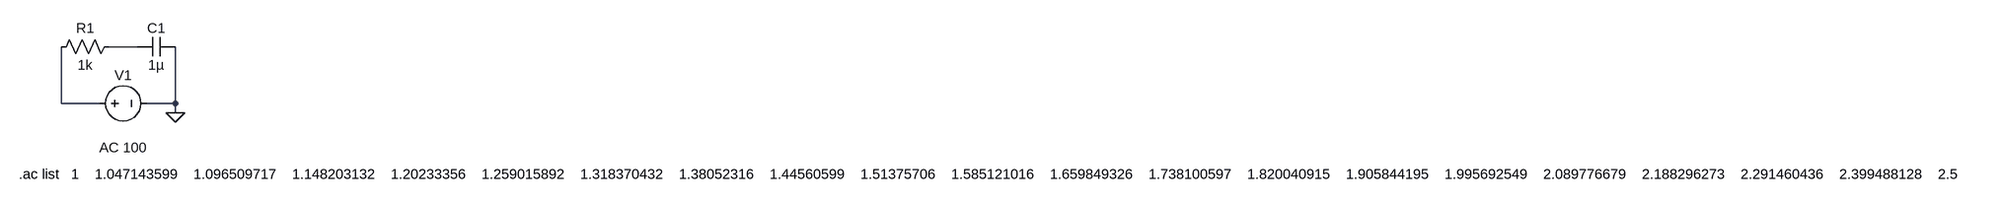
[diagram p0: schematic ac_low_high_pass_filter.asc]
ac_low_high_pass_filter.asc, the LTspice schematic file:
Version 4
SHEET 1 25912 680
WIRE 288 80 240 80
WIRE 160 176 160 80
WIRE 224 176 160 176
WIRE 352 176 352 80
WIRE 352 176 304 176
WIRE 352 192 352 176
FLAG 352 192 0
SYMBOL res 256 64 R90
WINDOW 0 0 56 VBottom 2
WINDOW 3 32 56 VTop 2
SYMATTR InstName R1
SYMATTR Value 1k
SYMBOL cap 352 64 R90
WINDOW 0 0 32 VBottom 2
WINDOW 3 32 32 VTop 2
SYMATTR InstName C1
SYMATTR Value 1µ
SYMBOL voltage 208 176 R270
WINDOW 0 32 56 VTop 2
WINDOW 3 -32 56 VBottom 2
WINDOW 123 -60 56 VBottom 2
WINDOW 39 0 0 Left 2
SYMATTR InstName V1
SYMATTR Value ""
SYMATTR Value2 AC 100
TEXT 88 296 Left 2 !.ac list   1	1.047143599	1.096509717	1.148203132	1.20233356	1.259015892	1.318370432	1.38052316	1.44560599	1.51375706	1.585121016	1.659849326	1.738100597	1.820040915	1.905844195	1.995692549	2.089776679	2.188296273	2.291460436	2.399488128	2.512608635	2.631062049	2.755099784	2.884985104	3.020993686	3.163414201	3.312548933	3.468714412	3.632242094	3.80347906	3.982788752	4.170551749	4.367166569	4.573050519	4.78864058	5.014394333	5.250790929	5.498332112	5.757543278	6.028974591	6.313202153	6.610829225	6.922487508	7.248838485	7.590574821	7.948421838	8.323139052	8.715521784	9.12640285	9.556654328	10.00718941	10.47896434	10.97298043	11.49028622	12.03197967	12.5992105	13.19318263	13.81515674	14.46645296	15.14845362	15.86260624	16.61042659	17.39350189	18.21349417	19.07214384	19.97127335	20.91279105	21.89869529	22.93107861	24.01213219	25.14415052	26.32953628	27.57080538	28.87059238	30.23165602	31.65688509	33.1493046	34.71208213	36.34853462	38.06213536	39.85652142	41.73550129	43.70306304	45.76338273	47.9208333	50.17999386	52.54565938	55.02285088	57.61682611	60.33309067	63.17740972	66.1558202	69.27464368	72.54049972	75.96031996	79.54136284	83.29122897	87.21787729	91.32964194	95.63524998	100.1438399	104.8649809	109.8086936	114.9854706	120.4062995	126.0826859	132.0266775	138.2508903	144.7685348	151.5934446	158.7401052	166.2236851	174.0600679	182.265886	190.8585558	199.8563151	209.2782611	219.1443916	229.475647	240.2939549	251.6222768	263.4846566	275.9062716	288.9134863	302.5339079	316.7964452	331.7313699	347.3703806	363.7466706	380.8949979	398.851759	417.6550665	437.3448296	457.9628389	479.5528555	502.1607031	525.834366	550.6240906	576.5824921	603.764666	632.2283055	662.0338233	693.2444805	725.9265205	760.1493094	795.9854838	833.5111045	872.8058179	913.9530256	957.0400608	1002.158374	1049.403727	1098.876395	1150.681384	1204.928646	1261.733319	1321.215969	1383.502845	1448.726148	1517.024313	1588.5423	1663.431901	1741.852068	1823.969244	1909.957719	2000

The netlist it stands for:
* ac_low_high_pass_filter.asc
R1 N001 N002 1k
C1 0 N001 1µ
V1 N002 0 AC 100
.ac list   1	1.047143599	1.096509717	1.148203132	1.20233356	1.259015892	1.318370432	1.38052316	1.44560599	1.51375706	1.585121016	1.659849326	1.738100597	1.820040915	1.905844195	1.995692549	2.089776679	2.188296273	2.291460436	2.399488128	2.512608635	2.631062049	2.755099784	2.884985104	3.020993686	3.163414201	3.312548933	3.468714412	3.632242094	3.80347906	3.982788752	4.170551749	4.367166569	4.573050519	4.78864058	5.014394333	5.250790929	5.498332112	5.757543278	6.028974591	6.313202153	6.610829225	6.922487508	7.248838485	7.590574821	7.948421838	8.323139052	8.715521784	9.12640285	9.556654328	10.00718941	10.47896434	10.97298043	11.49028622	12.03197967	12.5992105	13.19318263	13.81515674	14.46645296	15.14845362	15.86260624	16.61042659	17.39350189	18.21349417	19.07214384	19.97127335	20.91279105	21.89869529	22.93107861	24.01213219	25.14415052	26.32953628	27.57080538	28.87059238	30.23165602	31.65688509	33.1493046	34.71208213	36.34853462	38.06213536	39.85652142	41.73550129	43.70306304	45.76338273	47.9208333	50.17999386	52.54565938	55.02285088	57.61682611	60.33309067	63.17740972	66.1558202	69.27464368	72.54049972	75.96031996	79.54136284	83.29122897	87.21787729	91.32964194	95.63524998	100.1438399	104.8649809	109.8086936	114.9854706	120.4062995	126.0826859	132.0266775	138.2508903	144.7685348	151.5934446	158.7401052	166.2236851	174.0600679	182.265886	190.8585558	199.8563151	209.2782611	219.1443916	229.475647	240.2939549	251.6222768	263.4846566	275.9062716	288.9134863	302.5339079	316.7964452	331.7313699	347.3703806	363.7466706	380.8949979	398.851759	417.6550665	437.3448296	457.9628389	479.5528555	502.1607031	525.834366	550.6240906	576.5824921	603.764666	632.2283055	662.0338233	693.2444805	725.9265205	760.1493094	795.9854838	833.5111045	872.8058179	913.9530256	957.0400608	1002.158374	1049.403727	1098.876395	1150.681384	1204.928646	1261.733319	1321.215969	1383.502845	1448.726148	1517.024313	1588.5423	1663.431901	1741.852068	1823.969244	1909.957719	2000
.backanno
.end